# Altium schematic sheet USB to SATA bridge.SchDoc
size A3; SheetNumber: 2; SheetTotal: 3
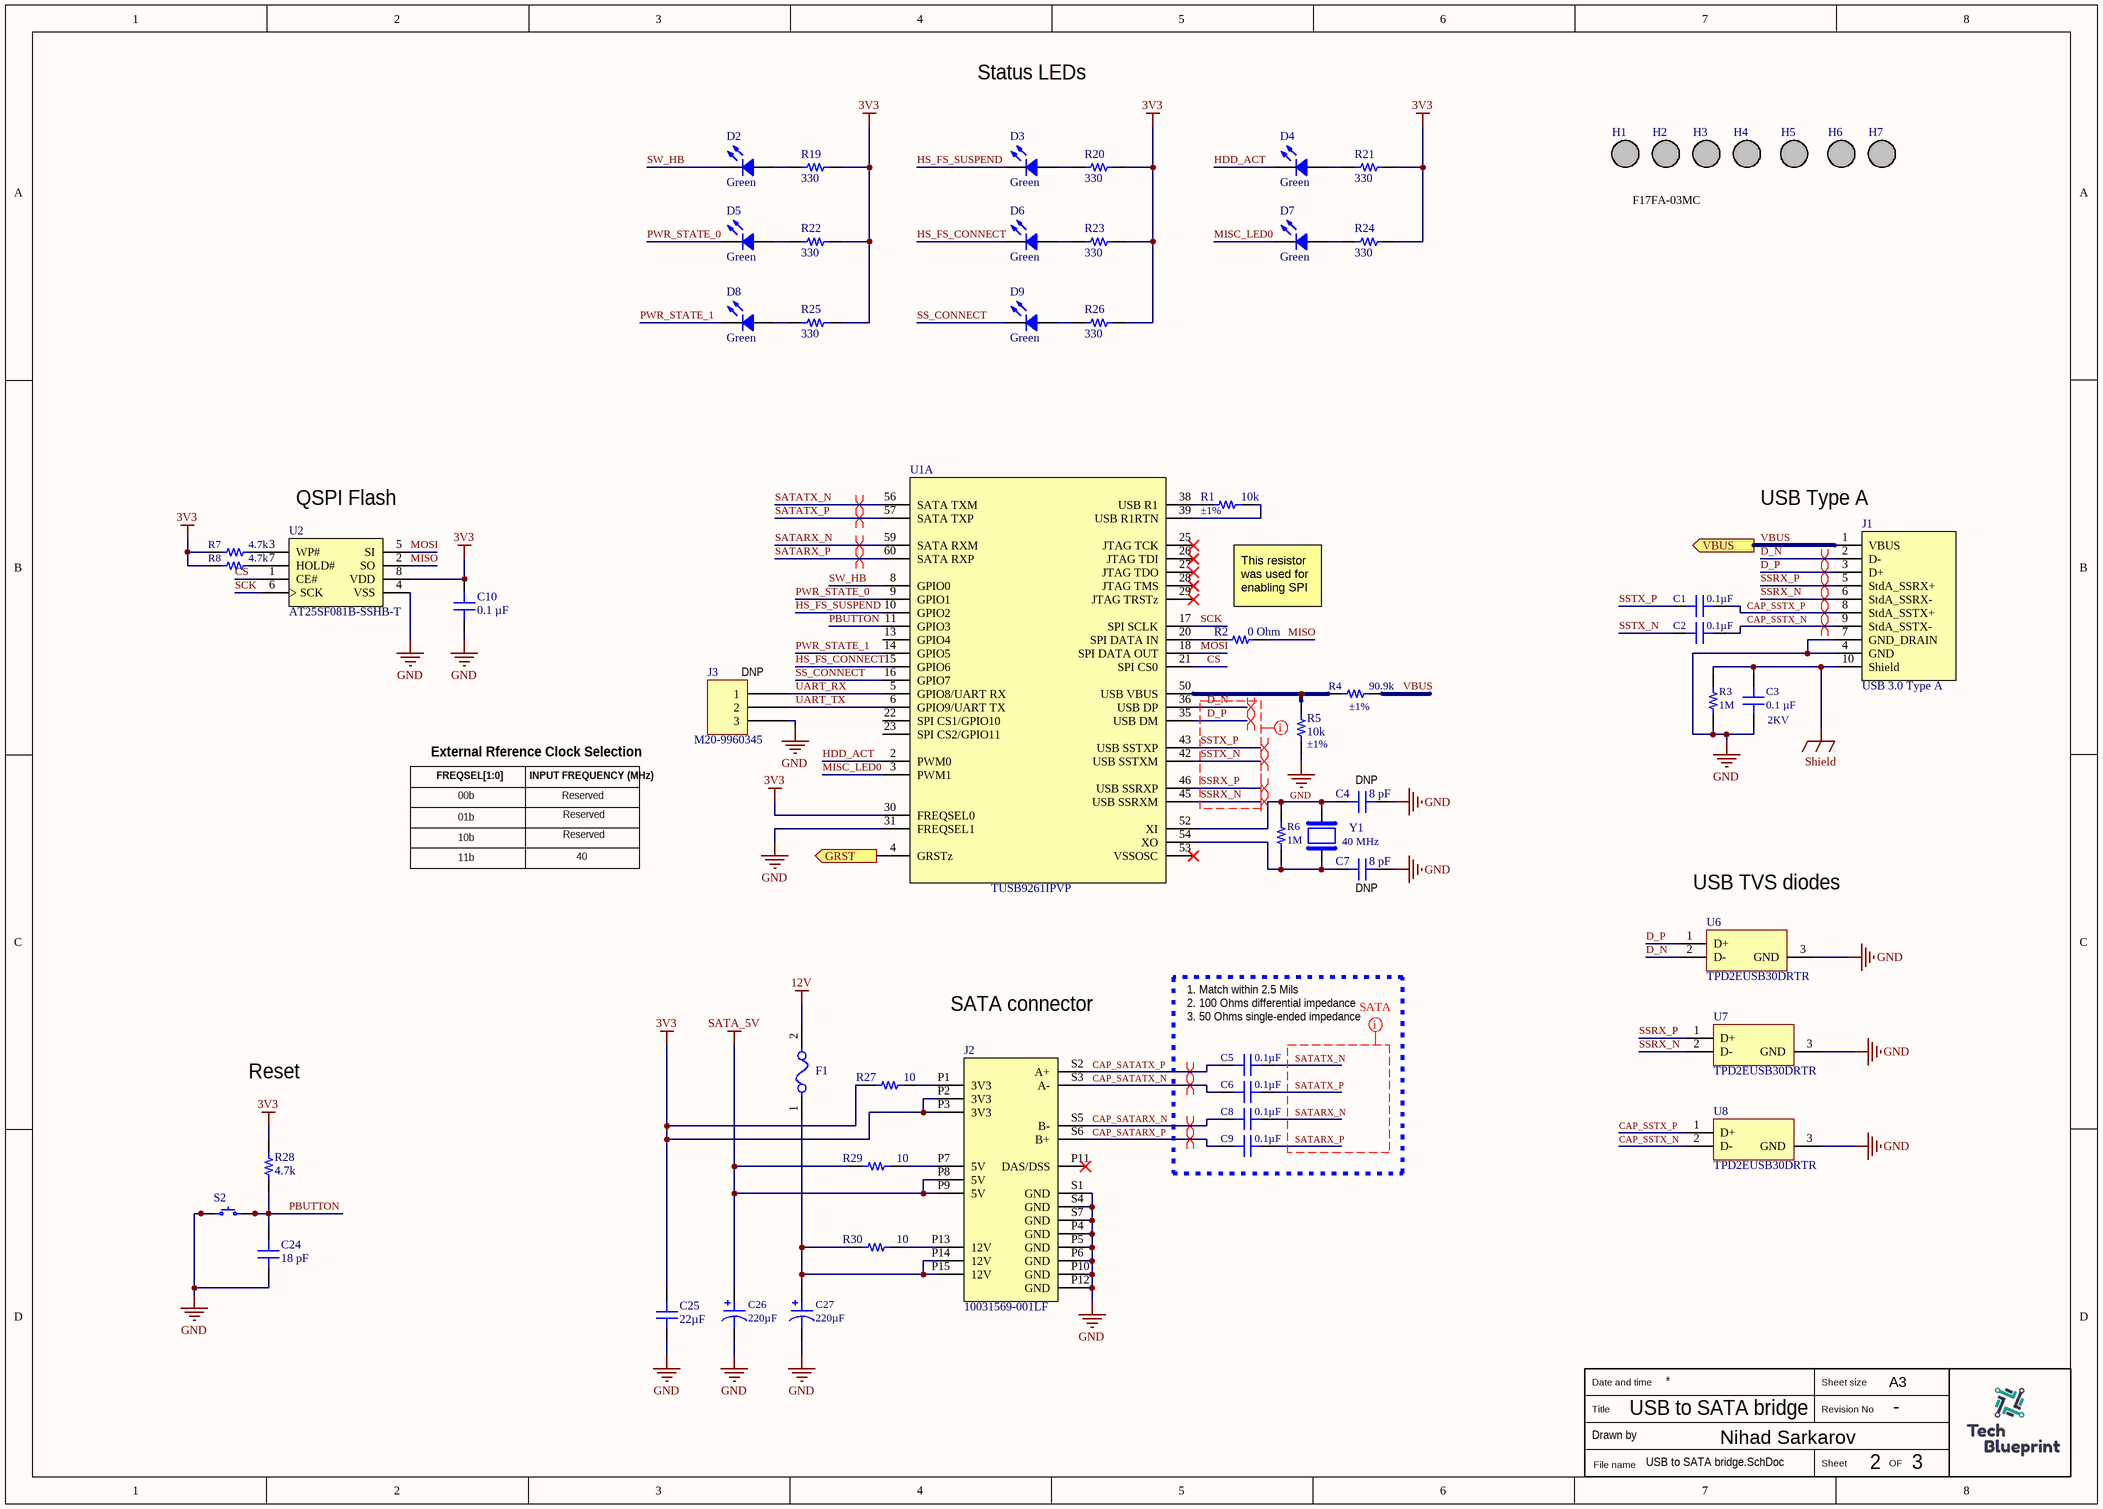
[diagram p0: USB to SATA bridge.SchDoc]

## Parts
C1  0.1µF  [CAP 0402_1005]
C2  0.1µF  [CAP 0402_1005]
C3  Voltage - Rated: 2KV  [MURATA GRM155 0402_1005]  (hidden comment: 0.1 µF)
C4  8 pF  [MURATA GCM155 0402_1005]
C5  0.1µF  [CAP 0402_1005]
C6  0.1µF  [CAP 0402_1005]
C7  8 pF  [MURATA GCM155 0402_1005]
C8  0.1µF  [CAP 0402_1005]
C9  0.1µF  [CAP 0402_1005]
C10  0.1 µF  [CAP 0603_1608]
C24  18 pF  [CAP 0402_1005]
C25  22µF  [CAP 1206_3216 - 1.8MM]
C26  220µF  [CAP ALSMD 8.3MM H10.5MM]
C27  220µF  [CAP ALSMD 8.3MM H10.5MM]
D2  Green  [LED 0805_2012 GREEN]
D3  Green  [LED 0805_2012 GREEN]
D4  Green  [LED 0805_2012 GREEN]
D5  Green  [LED 0805_2012 GREEN]
D6  Green  [LED 0805_2012 GREEN]
D7  Green  [LED 0805_2012 GREEN]
D8  Green  [LED 0805_2012 GREEN]
D9  Green  [LED 0805_2012 GREEN]
F1  MINISMDC150F/24-2  [FP-MINISMDC150F-MFG]  (value not drawn)
H1  Hole  [Hole]  (value not drawn)
H2  Hole  [Hole]  (value not drawn)
H3  Hole  [Hole]  (value not drawn)
H4  Mounting hole  [Mounting hole]  (value not drawn)
H5  Mounting hole  [Mounting hole]  (value not drawn)
H6  Mounting hole  [Mounting hole]  (value not drawn)
H7  Mounting hole  [Mounting hole]  (value not drawn)
J1  USB 3.0 Type A  [USB 3.0 Type A]
J2  10031569-001LF  [AMPHENOL_10031569-001LF]
J3  M20-9960345  [HARWIN M20-9960345]
R1  Tolerance: ±1%  [YAGEO RES 0402_1005]  (hidden comment: 10k)
R2  0 Ohm  [RES 0603_1608]
R3  1M  [RES 0603_1608]
R4  Tolerance: ±1%  [RES 0603_1608]  (hidden comment: 90.9k)
R5  Tolerance: ±1%  [YAGEO RES 0603_1608]  (hidden comment: 10k)
R6  1M  [YAGEO RES 0402_1005]
R7  4.7k  [RES 0603_1608]
R8  4.7k  [RES 0603_1608]
R19  330  [YAGEO RES 0402_1005]
R20  330  [YAGEO RES 0402_1005]
R21  330  [YAGEO RES 0402_1005]
R22  330  [YAGEO RES 0402_1005]
R23  330  [YAGEO RES 0402_1005]
R24  330  [YAGEO RES 0402_1005]
R25  330  [YAGEO RES 0402_1005]
R26  330  [YAGEO RES 0402_1005]
R27  10  [RES 1206_3216]
R28  4.7k  [YAGEO RES 0402_1005]
R29  10  [RES 1206_3216]
R30  10  [RES 1206_3216]
S2  PTS645SM43SMTR92 LFS  [C&K PTS645]  (value not drawn)
U1  TUSB9261IPVP  [FP-PVP0064A-IPC_A]  (part A of 2)
U2  AT25SF081B-SSHB-T  [SOIC127P790X216-8N]
U6  TPD2EUSB30DRTR  [DRT0003A]
U7  TPD2EUSB30DRTR  [DRT0003A]
U8  TPD2EUSB30DRTR  [DRT0003A]
Y1  Frequency: 40 MHz  [XTAL_SXT22412AA16-40.000MT]  (hidden comment: SXT22412AA07-40.000M)

## Ports
GRST (out, see Power[3D]), VBUS (out, see Power[7A])

## Nets
3V3: C10.2 C25.2 J2.P2(3V3) J2.P3(3V3) R7.1 R8.1 R19.2 R20.2 R21.2 R22.2 R23.2 R24.2 R25.2 R26.2 R27.1 R28.2 U1.30(FREQSEL0) U2.8(VDD)
12V: F1.2
GND: C3.1 C4.2 C7.2 C10.1 C24.1 C25.1 C26.2 C27.2 J1.4(GND) J1.7(GND_DRAIN) J2.P4(GND) J2.P5(GND) J2.P6(GND) J2.P10(GND) J2.P12(GND) J2.S1(GND) J2.S4(GND) J2.S7(GND) J3.3 R3.1 R5.1 S2.1 S2.2 U1.31(FREQSEL1) U2.4(VSS) U6.3(GND) U7.3(GND) U8.3(GND)
SATA_5V: C26.1 J2.P8(5V) J2.P9(5V) R29.1
Shield: C3.2 J1.10(Shield) R3.2
CAP_SATARX_N: C8.1 J2.S5(B-)
CAP_SATARX_P: C9.1 J2.S6(B+)
CAP_SATATX_N: C6.1 J2.S3(A-)
CAP_SATATX_P: C5.1 J2.S2(A+)
CAP_SSTX_N: C2.2 J1.9(StdA_SSTX-) U8.2(D-)
CAP_SSTX_P: C1.2 J1.8(StdA_SSTX+) U8.1(D+)
CS: U1.21(SPI_CS0) U2.1(CE#)
D_N: J1.2(D-) U1.36(USB_DP) U6.2(D-)
D_P: J1.3(D+) U1.35(USB_DM) U6.1(D+)
GRST: U1.4(GRSTz) ; port GRST
HDD_ACT: D4.2 U1.2(PWM0)
HS_FS_CONNECT: D6.2 U1.15(GPIO6)
HS_FS_SUSPEND: D3.2 U1.10(GPIO2)
MISC_LED0: D7.2 U1.3(PWM1)
MISO: R2.2 U2.2(SO)
MOSI: U1.18(SPI_DATA_OUT) U2.5(SI)
PBUTTON: C24.2 R28.1 S2.3 S2.4 U1.11(GPIO3)
PWR_STATE_0: D5.2 U1.9(GPIO1)
PWR_STATE_1: D8.2 U1.14(GPIO5)
SATARX_N: C8.2 U1.59(SATA_RXM)
SATARX_P: C9.2 U1.60(SATA_RXP)
SATATX_N: C5.2 U1.56(SATA_TXM)
SATATX_P: C6.2 U1.57(SATA_TXP)
SCK: U1.17(SPI_SCLK) U2.6(SCK)
SS_CONNECT: D9.2 U1.16(GPIO7)
SSRX_N: J1.6(StdA_SSRX-) U1.45(USB_SSRXM) U7.2(D-)
SSRX_P: J1.5(StdA_SSRX+) U1.46(USB_SSRXP) U7.1(D+)
SSTX_N: C2.1 U1.42(USB_SSTXM)
SSTX_P: C1.1 U1.43(USB_SSTXP)
SW_HB: D2.2 U1.8(GPIO0)
UART_RX: J3.1 U1.5(GPIO8/UART_RX)
UART_TX: J3.2 U1.6(GPIO9/UART_TX)
VBUS: J1.1(VBUS) R4.2 ; port VBUS
NetC4_1: C4.1 R6.2 U1.52(XI) Y1.3
NetC7_1: C7.1 R6.1 U1.54(XO) Y1.1
NetC27_1: C27.1 F1.1 J2.P14(12V) J2.P15(12V) R30.1
NetD2_1: D2.1 R19.1
NetD3_1: D3.1 R20.1
NetD4_1: D4.1 R21.1
NetD5_1: D5.1 R22.1
NetD6_1: D6.1 R23.1
NetD7_1: D7.1 R24.1
NetD8_1: D8.1 R25.1
NetD9_1: D9.1 R26.1
NetJ2_P1: J2.P1(3V3) R27.2
NetJ2_P7: J2.P7(5V) R29.2
NetJ2_P13: J2.P13(12V) R30.2
NetR1_1: R1.1 U1.38(USB_R1)
NetR1_2: R1.2 U1.39(USB_R1RTN)
NetR2_1: R2.1 U1.20(SPI_DATA_IN)
NetR4_1: R4.1 R5.2 U1.50(USB_VBUS)
NetR7_2: R7.2 U2.3(WP#)
NetR8_2: R8.2 U2.7(HOLD#)

Not connected (* = marked no-connect by the designer): J2 P11(DAS/DSS)*; U1 13(GPIO4) 22(SPI_CS1/GPIO10) 23(SPI_CS2/GPIO11) 25(JTAG_TCK)* 26(JTAG_TDI)* 27(JTAG_TDO)* 28(JTAG_TMS)* 29(JTAG_TRSTz)* 53(VSSOSC)*

## Layout directives
differential pair; differential pair class USB90: CAP_SSTX_N, CAP_SSTX_P, D_N, D_P, SSRX_N, SSRX_P, SSTX_N, SSTX_P
differential pair; differential pair class SATA100: CAP_SATARX_N, CAP_SATARX_P, CAP_SATATX_N, CAP_SATATX_P, SATARX_N, SATARX_P, SATATX_N, SATATX_P
net class SATA: SATARX_N, SATARX_P, SATATX_N, SATATX_P
net class USB_3.0: D_N, D_P, SSRX_N, SSRX_P, SSTX_N, SSTX_P

## Notes on the sheet
- Status LEDs
- F17FA-03MC
- QSPI Flash
- (near J1) USB Type A
- This resistor was used for enabling SPI
- (near J3) DNP
- External Rference Clock Selection
- FREQSEL[1:0]
- INPUT FREQUENCY (MHz)
- (near C4) DNP
- 00b
- 01b
- 10b
- Reserved
- 11b
- 40
- (near C7) DNP
- (near U6) USB TVS diodes
- 1. Match within 2.5 Mils
- SATA connector
- 2. 100 Ohms differential impedance
- (near C5) 3. 50 Ohms single-ended impedance
- Reset
- USB to SATA bridge
- -
- 2
- 3
- Date and time
- Sheet size
- A3
- Title
- Drawn by
- File name
- Nihad Sarkarov
- Sheet
- Revision No
- OF

## Library data of the parts
C1 C2 C5 C6 C8 C9 = 0402YC104JAT4A: CAP CER 0.1UF 16V X7R 0402; manufacturer: AVX Corporation; Tolerance: ±5%; Part Number: 0402YC104JAT4A; Capacitance: 0.1µF; Applications: General Purpose; componentlink1description: Datasheet; componentlink1url: http://datasheets.avx.com/X7RDielectric.pdf; componentlink2description: DigiKey Link; componentlink2url: http://digikey.com/product-detail/en/avx-corporation/0402YC104JAT4A/478-11502-1-ND/8107703; Device Package: 0402 (1005 Metric); lastupdated: 2/8/2022 12:26:57 PM; Lifecycle Status: Active; Minimum Order: 1; Mounting Type: Surface Mount, MLCC; Operating Temperature: -55°C ~ 125°C; Package / Case: 0402 (1005 Metric); packaging: CutTape; partid: 2382; Part Status: Active; price: 0.10; series: -; Size / Dimension: 0.039" L x 0.020" W (1.00mm x 0.50mm); Supplier 1: DigiKey; Supplier Part Number 1: 478-11502-1-ND; Temperature Coefficient: X7R; Thickness (Max): 0.022" (0.56mm); value: 0.1µF; Voltage - Rated: 16V
C3 = GRM155R62A104ME14D: CAP CER 0.1UF 100V X5R 0402; manufacturer: Murata Electronics; Tolerance: ±20%; Part Number: GRM155R62A104ME14D; Capacitance: 0.1 µF; Applications: General Purpose; componentlink1description: Datasheet; componentlink1url: https://search.murata.co.jp/Ceramy/image/img/A01X/G101/ENG/GRM155R62A104ME14-01.pdf; componentlink2description: DigiKey Link; componentlink2url: https://www.digikey.com/en/products/detail/murata-electronics/GRM155R62A104ME14D/5027544; Device Package: 0402 (1005 Metric); lastupdated: 7/25/2024 4:50:24 AM; Lifecycle Status: Active; Minimum Order: 1; Mounting Type: Surface Mount, MLCC; Operating Temperature: -55°C ~ 85°C; Package / Case: 0402 (1005 Metric); packaging: TapeAndReel; partid: 2773; Part Status: Active; price: 0.01; series: GRM; Size / Dimension: 0.039" L x 0.020" W (1.00mm x 0.50mm); Supplier 1: DigiKey; Supplier Part Number 1: 490-10459-1-ND; Temperature Coefficient: X5R; Thickness (Max): 0.022" (0.55mm); value: 0.1 µF
C4 C7 = GCM1555C1H8R0DA16D: CAP CER 8PF 50V C0G/NP0 0402; manufacturer: Murata Electronics; Temperature Coefficient: C0G, NP0; Tolerance: ±0.5pF; Part Number: GCM1555C1H8R0DA16D; Capacitance: 8 pF; Applications: Automotive; componentlink1description: Datasheet; componentlink1url: https://www.murata.com/~/media/webrenewal/support/library/catalog/products/capacitor/mlcc/c03e.ashx?la=en-us; componentlink2description: DigiKey Link; componentlink2url: https://www.digikey.com/en/products/detail/murata-electronics/GCM1555C1H8R0DA16D/4903668; Device Package: 0402 (1005 Metric); lastupdated: 7/20/2024 2:04:19 AM; Lifecycle Status: Active; Minimum Order: 1; Mounting Type: Surface Mount, MLCC; Operating Temperature: -55°C ~ 125°C; Package / Case: 0402 (1005 Metric); packaging: TapeAndReel; partid: 3031; Part Status: Active; price: 0.01; Ratings: AEC-Q200; series: GCM; Size / Dimension: 0.039" L x 0.020" W (1.00mm x 0.50mm); Supplier 1: DigiKey; Supplier Part Number 1: 490-13294-1-ND; Thickness (Max): 0.022" (0.55mm); value: 8 pF; Voltage - Rated: 50V
C10 = CL10B104KB85PND: CAP CER 0.1UF 50V X7R 0603; manufacturer: Samsung Electro-Mechanics; Tolerance: ±10%; Part Number: CL10B104KB85PND; Capacitance: 0.1 µF; Applications: Automotive; componentlink1description: Datasheet; componentlink1url: http://www.samsungsem.com/kr/support/product-search/mlcc/CL10B104KB85PND.jsp; componentlink2description: DigiKey Link; componentlink2url: https://www.digikey.com/en/products/detail/samsung-electro-mechanics/CL10B104KB85PND/7320490; Device Package: 0603 (1608 Metric); Features: Open Mode; lastupdated: 2/9/2024 8:10:28 PM; Lifecycle Status: Active; Minimum Order: 1; Mounting Type: Surface Mount, MLCC; Operating Temperature: -55°C ~ 125°C; Package / Case: 0603 (1608 Metric); packaging: TapeAndReel; partid: 4208; Part Status: Active; price: 0.01; Ratings: AEC-Q200; series: CL; Size / Dimension: 0.063" L x 0.031" W (1.60mm x 0.80mm); Supplier 1: DigiKey; Supplier Part Number 1: 1276-6985-1-ND; Temperature Coefficient: X7R; Thickness (Max): 0.035" (0.90mm); value: 0.1 µF; Voltage - Rated: 50V
C24 = CGA2B2C0G1H180J050BA: CAP CER 18PF 50V C0G 0402; manufacturer: TDK Corporation; Temperature Coefficient: C0G, NP0; Tolerance: ±5%; Part Number: CGA2B2C0G1H180J050BA; Capacitance: 18 pF; Applications: Automotive; componentlink1description: Datasheet; componentlink1url: https://product.tdk.com/info/en/catalog/datasheets/mlcc_automotive_general_en.pdf?ref_disty=digikey; componentlink2description: DigiKey Link; componentlink2url: https://www.digikey.com/en/products/detail/tdk-corporation/CGA2B2C0G1H180J050BA/2443065; Device Package: 0402 (1005 Metric); lastupdated: 2/9/2024 8:04:35 PM; Lifecycle Status: Active; Minimum Order: 1; Mounting Type: Surface Mount, MLCC; Operating Temperature: -55°C ~ 125°C; Package / Case: 0402 (1005 Metric); packaging: TapeAndReel; partid: 3334; Part Status: Active; price: 0.01; Ratings: AEC-Q200; series: CGA; Size / Dimension: 0.039" L x 0.020" W (1.00mm x 0.50mm); Supplier 1: DigiKey; Supplier Part Number 1: 445-5587-1-ND; Thickness (Max): 0.022" (0.55mm); value: 18 pF; Voltage - Rated: 50V
C25 = 1206YD226KAT2A: CAP CER 22UF 16V X5R 1206; manufacturer: AVX Corporation; Tolerance: ±10%; Part Number: 1206YD226KAT2A; Capacitance: 22µF; Applications: General Purpose; componentlink1description: Datasheet; componentlink1url: http://datasheets.avx.com/cx5r.pdf; componentlink2description: DigiKey Link; componentlink2url: http://digikey.com/product-detail/en/avx-corporation/1206YD226KAT2A/478-5727-1-ND/2136335; Device Package: 1206 (3216 Metric); lastupdated: 9/2/2020 1:05:39 AM; Lifecycle Status: Active; Minimum Order: 1; Mounting Type: Surface Mount, MLCC; Operating Temperature: -55°C ~ 85°C; Package / Case: 1206 (3216 Metric); packaging: TapeAndReel; partid: 20319; Part Status: Active; price: 0.48; series: -; Size / Dimension: 0.126" L x 0.063" W (3.20mm x 1.60mm); Supplier 1: DigiKey; Supplier Part Number 1: 478-5727-1-ND; Temperature Coefficient: X5R; Thickness (Max): 0.070" (1.78mm); value: 22µF; Voltage - Rated: 16V
C26 C27 = UUR1E221MNL6GS: CAP ALUM 220UF 20% 25V SMD; manufacturer: Nichicon; Lifetime @ Temp.: 2000 Hrs @ 85°C; Ripple Current @ High Frequency: 301.6mA @ 10kHz; Ripple Current @ Low Frequency: 232mA @ 120Hz; Surface Mount Land Size: 0.327" L x 0.327" W (8.30mm x 8.30mm); Part Number: UUR1E221MNL6GS; Applications: General Purpose; Capacitance: 220µF; componentlink1description: Datasheet; componentlink1url: http://nichicon-us.com/english/products/pdfs/e-uur.pdf; componentlink2description: DigiKey Link; componentlink2url: http://digikey.com/product-detail/en/nichicon/UUR1E221MNL6GS/493-6222-1-ND/3438735; Device Package: Radial, Can - SMD; Height - Seated (Max): 0.413" (10.50mm); lastupdated: 9/2/2020 1:25:16 AM; Lifecycle Status: Active; Minimum Order: 1; Mounting Type: Surface Mount; Operating Temperature: -40°C ~ 85°C; Package / Case: Radial, Can - SMD; packaging: TapeAndReel; partid: 7456; Part Status: Active; price: 0.19; series: UUR; Size / Dimension: 0.315" Dia (8.00mm); Supplier 1: DigiKey; Supplier Part Number 1: 493-6222-1-ND; Tolerance: ±20%; value: 220µF; Voltage - Rated: 25V
D2-D9 = QBLP631-YG1-2943: 0805 LED RED 570NM DOMINANT, 565; Manufacturer: QT Brightek (QTB); Configuration: Standard; Current - Test: 20mA; Lens Color: White; Lens Size: 1.30mm x 1.25mm; Lens Style: Rectangle with Flat Top; Lens Transparency: Diffused; Millicandela Rating: 15mcd; Viewing Angle: 140°; Voltage - Forward (Vf) (Typ): 2V; Wavelength - Peak: 565nm; Part Number: QBLP631-YG1-2943; Color: Green; ComponentLink1Description: Datasheet; ComponentLink1URL: https://www.qt-brightek.com/datasheet/QBLP631-YG1-2943.pdf; ComponentLink2Description: DigiKey Link; ComponentLink2URL: https://www.digikey.com/en/products/detail/qt-brightek-qtb/QBLP631-YG1-2943/22106671; Device Package: 0805 (2012 Metric); Height (Max): 0.90mm; LastUpdated: 6/3/2024 8:00:23 PM; Lifecycle Status: Active; Minimum Order: 1; Mounting Type: Surface Mount; Package / Case: 0805 (2012 Metric); Packaging: TapeAndReel; PartId: 1479; Price: 0.05; Series: QBLP631; Size / Dimension: 2.00mm L x 1.25mm W; Supplier 1: DigiKey; Supplier Part Number 1: 1516-QBLP631-YG1-2943CT-ND; Supplier Device Package: 0805; Value: Green; Wavelength - Dominant: 570nm
F1 = CMP-08606-000055-1: PTC RESET FUSE 24V 1.5A 1812; Manufacturer: Littelfuse; Trip Current: 3A; Value: 0.04-0.12Ω; Current Rating: 20A; Trip Time: 1.5s; Temperature: to +85°C; Digikey Description: PTC RESET FUSE 24V 1.5A 1812; Device Class L3: unset; Device Class L2: PTC Resettable Fuses; RoHS: TRUE; Ambient Temperature Range High: +85°C; Category: Fuse; Device Class L1: Circuit Protection; Hold Current: 1.5A; Resistance: 0.04-0.12Ω; ComponentLink2URL: https://www.littelfuse.com/~/media/electronics/datasheets/resettable_ptcs/littelfuse_ptc_minismdc_datasheet.pdf.pdf; ComponentLink2Description: Datasheet; Package: MINISMDC150F; Ambient Temperature Range Low: -40°C; Height: 1.94mm; Octopart: https://octopart.com/minismdc150f%2F24-2-littelfuse-74215024; Manufacturer Part Number: MINISMDC150F/24-2; Automotive: No; Voltage Rating: 24V; Temperature Range High: +85°C; Lead Free: Yes
J1 = USB 3.0 Type A: USB 3.0 Type A male connector
J2 = 10031569-001LF: MF: {'manufacturer': u'Amphenol ICC'}; Package: None; Price: None; Value: *; MP: 10031569-001LF; Availability: Unavailable
J3 = M20-9960345: CONN HEADER R/A 3POS 2.54MM; Manufacturer: Harwin Inc.; Connector Type: Header, Cuttable; Contact Length - Mating: 0.240" (6.10mm); Contact Length - Post: 0.118" (3.00mm); Current Rating (Amps): 3A per Contact; Material Flammability Rating: UL94 V-0; Number of Positions: 3; Number of Positions Loaded: All; Pitch - Mating: 0.100" (2.54mm); Row Spacing - Mating: -40°C ~ 105°C; Shrouding: Unshrouded; Style: Board to Board or Cable; Part Number: M20-9960345; ComponentLink1Description: Datasheet; ComponentLink1URL: https://cdn.harwin.com/pdfs/Harwin_PC_Connectors_M20.pdf; ComponentLink2Description: DigiKey Link; ComponentLink2URL: https://www.digikey.com/en/products/detail/harwin-inc/M20-9960345/3728209; Contact Finish - Mating: Gold; Contact Material: Brass; Contact Shape: Square; Contact Type: Male Pin; Fastening Type: Push-Pull; Insulation Color: Black; Insulation Height: 0.100" (2.54mm); Insulation Material: Polyamide (PA6T), Nylon 6T; LastUpdated: 9/21/2022 7:23:07 PM; Lifecycle Status: Active; Minimum Order: 1; Mounting Type: Through Hole, Right Angle; Number of Rows: 1; Operating Temperature: -40°C ~ 105°C; Packaging: Bulk; PartId: 166; Part Status: Active; Price: 0.09; Series: M20; Supplier 1: DigiKey; Supplier Part Number 1: 952-2245-ND; Termination: Solder
R1 = SR0402FR-7T10KL: RES 10K OHM 1% 1/5W 0402; Manufacturer: Yageo; Power (Watts): 0.2W, 1/5W; Resistance: 10 kOhms; Temperature Coefficient: ±100ppm/°C; Part Number: SR0402FR-7T10KL; Value: 10k; ComponentLink1Description: Datasheet; ComponentLink1URL: http://www.yageo.com/documents/recent/PYu-SR_D_F%20tol_RoHS_L_4.pdf; ComponentLink2Description: DigiKey Link; ComponentLink2URL: https://www.digikey.com/en/products/detail/yageo/SR0402FR-7T10KL/9373089; Composition: Thick Film; Device Package: 0402 (1005 Metric); Features: Automotive AEC-Q200, Pulse Withstanding; Height - Seated (Max): 0.016" (0.40mm); LastUpdated: 7/25/2024 9:18:17 AM; Lifecycle Status: Active; Minimum Order: 1; Number of Terminations: 2; Operating Temperature: -55°C ~ 155°C; Package / Case: 0402 (1005 Metric); Packaging: TapeAndReel; PartId: 4411; Part Status: Active; Price: 0.09; Ratings: AEC-Q200; Series: SR; Size / Dimension: 0.039" L x 0.020" W (1.00mm x 0.50mm); Supplier 1: DigiKey; Supplier Part Number 1: YAG5815CT-ND; Supplier Device Package: 0402
R2 = RCS06030000Z0EC: RCS0603 0R0 ET6 E3; Manufacturer: Vishay Dale; Power (Watts): 0.25W, 1/4W; Resistance: 0 Ohms; Tolerance: Jumper; Part Number: RCS06030000Z0EC; Value: 0 Ohm; ComponentLink1Description: Datasheet; ComponentLink1URL: http://www.vishay.com/docs/20065/rcse3.pdf; ComponentLink2Description: DigiKey Link; ComponentLink2URL: https://www.digikey.com/en/products/detail/vishay-dale/RCS06030000Z0EC/10059623; Composition: Thick Film; Device Package: 0603 (1608 Metric); Features: Automotive AEC-Q200, Pulse Withstanding; Height - Seated (Max): 0.020" (0.50mm); LastUpdated: 2/9/2024 8:42:16 PM; Lifecycle Status: Active; Minimum Order: 1; Number of Terminations: 2; Operating Temperature: -55°C ~ 155°C; Package / Case: 0603 (1608 Metric); Packaging: TapeAndReel; PartId: 23936; Part Status: Active; Price: 0.01; Ratings: AEC-Q200; Series: RCS e3; Size / Dimension: 0.061" L x 0.033" W (1.55mm x 0.85mm); Supplier 1: DigiKey; Supplier Part Number 1: 541-10557-1-ND; Supplier Device Package: 0603
R3 = RMCF0603JT1M00: RES 1M OHM 5% 1/10W 0603; Manufacturer: Stackpole Electronics Inc; Power (Watts): 0.1W, 1/10W; Resistance: 1 MOhms; Temperature Coefficient: ±200ppm/°C; Part Number: RMCF0603JT1M00; Value: 1M; ComponentLink1Description: Datasheet; ComponentLink1URL: https://www.seielect.com/catalog/sei-rmcf_rmcp.pdf; ComponentLink2Description: DigiKey Link; ComponentLink2URL: https://www.digikey.com/en/products/detail/stackpole-electronics-inc/RMCF0603JT1M00/1758066; Composition: Thick Film; Device Package: 0603 (1608 Metric); Features: Automotive AEC-Q200; Height - Seated (Max): 0.022" (0.55mm); LastUpdated: 2/9/2024 8:43:33 PM; Lifecycle Status: Active; Minimum Order: 1; Number of Terminations: 2; Operating Temperature: -55°C ~ 155°C; Package / Case: 0603 (1608 Metric); Packaging: CutTape; PartId: 5847; Part Status: Active; Price: 0.01; Ratings: AEC-Q200; Series: RMCF; Size / Dimension: 0.061" L x 0.031" W (1.55mm x 0.80mm); Supplier 1: DigiKey; Supplier Part Number 1: RMCF0603JT1M00CT-ND; Supplier Device Package: 0603; Tolerance: ±5%
R4 = MCT06030C9092FP500: RES SMD 90.9K OHM 1% 1/8W 0603; Manufacturer: Vishay Beyschlag; Power (Watts): 0.125W, 1/8W; Resistance: 90.9 kOhms; Temperature Coefficient: ±50ppm/°C; Part Number: MCT06030C9092FP500; Value: 90.9k; ComponentLink1Description: Datasheet; ComponentLink1URL: http://www.vishay.com/docs/28705/mcx0x0xpro.pdf; ComponentLink2Description: DigiKey Link; ComponentLink2URL: http://digikey.com/product-detail/en/vishay-beyschlag/MCT06030C9092FP500/749-MCT06030C9092FP500CT-ND/10453922; Composition: Thin Film; Device Package: 0603 (1608 Metric); Features: Anti-Sulfur; Height - Seated (Max): 0.022" (0.55mm); LastUpdated: 2/9/2024 8:43:36 PM; Lifecycle Status: Active; Minimum Order: 1; Number of Terminations: 2; Operating Temperature: -55°C ~ 155°C; Package / Case: 0603 (1608 Metric); Packaging: TapeAndReel; PartId: 5107; Part Status: Active; Price: 0.02; Series: MCT - Professional; Size / Dimension: 0.061" L x 0.033" W (1.55mm x 0.85mm); Supplier 1: DigiKey; Supplier Part Number 1: 749-MCT06030C9092FP500CT-ND; Supplier Device Package: 0603
R5 = RT0603FRE0710KL: RES SMD 10K OHM 1% 1/10W 0603; Manufacturer: Yageo; Power (Watts): 0.1W, 1/10W; Resistance: 10 kOhms; Temperature Coefficient: ±50ppm/°C; Part Number: RT0603FRE0710KL; Value: 10k; ComponentLink1Description: Datasheet; ComponentLink1URL: https://www.yageo.com/upload/media/product/productsearch/datasheet/rchip/PYu-RT_1-to-0.01_RoHS_L_11.pdf; ComponentLink2Description: DigiKey Link; ComponentLink2URL: https://www.digikey.com/en/products/detail/yageo/RT0603FRE0710KL/1075040; Composition: Thin Film; Device Package: 0603 (1608 Metric); Height - Seated (Max): 0.022" (0.55mm); LastUpdated: 7/25/2024 9:19:32 AM; Lifecycle Status: Active; Minimum Order: 1; Number of Terminations: 2; Operating Temperature: -55°C ~ 155°C; Package / Case: 0603 (1608 Metric); Packaging: TapeAndReel; PartId: 5671; Part Status: Active; Price: 0.01; Series: RT; Size / Dimension: 0.063" L x 0.031" W (1.60mm x 0.80mm); Supplier 1: DigiKey; Supplier Part Number 1: YAG2321CT-ND; Supplier Device Package: 0603
R6 = AC0402JR-071ML: RES SMD 1M OHM 5% 1/16W 0402; Manufacturer: Yageo; Power (Watts): 0.063W, 1/16W; Resistance: 1 MOhms; Temperature Coefficient: ±100ppm/°C; Part Number: AC0402JR-071ML; Value: 1M; ComponentLink1Description: Datasheet; ComponentLink1URL: https://www.yageo.com/upload/media/product/productsearch/datasheet/rchip/PYu-AC_51_RoHS_L_7.pdf; ComponentLink2Description: DigiKey Link; ComponentLink2URL: https://www.digikey.com/en/products/detail/yageo/AC0402JR-071ML/5895610; Composition: Thick Film; Device Package: 0402 (1005 Metric); Features: Automotive AEC-Q200, Moisture Resistant; Height - Seated (Max): 0.015" (0.37mm); LastUpdated: 7/25/2024 9:18:18 AM; Lifecycle Status: Active; Minimum Order: 1; Number of Terminations: 2; Operating Temperature: -55°C ~ 155°C; Package / Case: 0402 (1005 Metric); Packaging: CutTape; PartId: 3387; Part Status: Active; Price: 0.01; Ratings: AEC-Q200; Series: AC; Size / Dimension: 0.039" L x 0.020" W (1.00mm x 0.50mm); Supplier 1: DigiKey; Supplier Part Number 1: YAG3526CT-ND; Supplier Device Package: 0402; Tolerance: ±5%
R7 R8 = RMCF0603JT4K70: RES 4.7K OHM 5% 1/10W 0603; Manufacturer: Stackpole Electronics Inc; Power (Watts): 0.1W, 1/10W; Resistance: 4.7 kOhms; Temperature Coefficient: ±200ppm/°C; Part Number: RMCF0603JT4K70; Value: 4.7k; ComponentLink1Description: Datasheet; ComponentLink1URL: https://www.seielect.com/catalog/sei-packaging.pdf; ComponentLink2Description: DigiKey Link; ComponentLink2URL: https://www.digikey.com/en/products/detail/stackpole-electronics-inc/RMCF0603JT4K70/1757976; Composition: Thick Film; Device Package: 0603 (1608 Metric); Features: Automotive AEC-Q200; Height - Seated (Max): 0.022" (0.55mm); LastUpdated: 2/9/2024 8:43:33 PM; Lifecycle Status: Active; Minimum Order: 1; Number of Terminations: 2; Operating Temperature: -55°C ~ 155°C; Package / Case: 0603 (1608 Metric); Packaging: CutTape; PartId: 5821; Part Status: Active; Price: 0.01; Ratings: AEC-Q200; Series: RMCF; Size / Dimension: 0.061" L x 0.031" W (1.55mm x 0.80mm); Supplier 1: DigiKey; Supplier Part Number 1: RMCF0603JT4K70CT-ND; Supplier Device Package: 0603; Tolerance: ±5%
R19-R26 = AC0402JR-07330RL: RES SMD 330 OHM 5% 1/16W 0402; Manufacturer: Yageo; Power (Watts): 0.063W, 1/16W; Resistance: 330 Ohms; Temperature Coefficient: ±100ppm/°C; Part Number: AC0402JR-07330RL; Value: 330; ComponentLink1Description: Datasheet; ComponentLink1URL: https://www.yageo.com/upload/media/product/productsearch/datasheet/rchip/PYu-AC_51_RoHS_L_7.pdf; ComponentLink2Description: DigiKey Link; ComponentLink2URL: https://www.digikey.com/en/products/detail/yageo/AC0402JR-07330RL/5895651; Composition: Thick Film; Device Package: 0402 (1005 Metric); Features: Automotive AEC-Q200, Moisture Resistant; Height - Seated (Max): 0.015" (0.37mm); LastUpdated: 7/25/2024 9:18:18 AM; Lifecycle Status: Active; Minimum Order: 1; Number of Terminations: 2; Operating Temperature: -55°C ~ 155°C; Package / Case: 0402 (1005 Metric); Packaging: CutTape; PartId: 3389; Part Status: Active; Price: 0.01; Ratings: AEC-Q200; Series: AC; Size / Dimension: 0.039" L x 0.020" W (1.00mm x 0.50mm); Supplier 1: DigiKey; Supplier Part Number 1: YAG3542CT-ND; Supplier Device Package: 0402; Tolerance: ±5%
R27 R29 R30 = RCC120610R0JNEA: RCC1206 200 10R 5% ET1 E3; Manufacturer: Vishay Dale; Power (Watts): 0.5W, 1/2W; Resistance: 10 Ohms; Temperature Coefficient: ±200ppm/°C; Value: 10 Ohms; Part Number: RCC120610R0JNEA; ComponentLink1Description: Datasheet; ComponentLink1URL: https://www.vishay.com/doc?20066; ComponentLink2Description: DigiKey Link; ComponentLink2URL: https://www.digikey.com/en/products/detail/vishay-dale/RCC120610R0JNEA/13667046; Composition: Thick Film; Device Package: 1206 (3216 Metric); Features: Automotive AEC-Q200; Height - Seated (Max): 0.024" (0.60mm); LastUpdated: 2/9/2024 8:53:25 PM; Lifecycle Status: Active; Minimum Order: 1; Number of Terminations: 2; Operating Temperature: -55°C ~ 155°C; Package / Case: 1206 (3216 Metric); Packaging: TapeAndReel; PartId: 58761; Part Status: Active; Price: 0.02; Ratings: AEC-Q200; Series: RCC e3; Size / Dimension: 0.126" L x 0.063" W (3.20mm x 1.60mm); Supplier 1: DigiKey; Supplier Part Number 1: 541-RCC120610R0JNEACT-ND; Supplier Device Package: 1206; Tolerance: ±5%
R28 = AC0402JR-074K7L: RES SMD 4.7K OHM 5% 1/16W 0402; Manufacturer: Yageo; Power (Watts): 0.063W, 1/16W; Resistance: 4.7 kOhms; Temperature Coefficient: ±100ppm/°C; Part Number: AC0402JR-074K7L; Value: 4.7k; ComponentLink1Description: Datasheet; ComponentLink1URL: https://www.yageo.com/upload/media/product/productsearch/datasheet/rchip/PYu-AC_51_RoHS_L_7.pdf; ComponentLink2Description: DigiKey Link; ComponentLink2URL: https://www.digikey.com/en/products/detail/yageo/AC0402JR-074K7L/2827810; Composition: Thick Film; Device Package: 0402 (1005 Metric); Features: Automotive AEC-Q200, Moisture Resistant; Height - Seated (Max): 0.015" (0.37mm); LastUpdated: 7/25/2024 9:18:18 AM; Lifecycle Status: Active; Minimum Order: 1; Number of Terminations: 2; Operating Temperature: -55°C ~ 155°C; Package / Case: 0402 (1005 Metric); Packaging: CutTape; PartId: 3400; Part Status: Active; Price: 0.01; Ratings: AEC-Q200; Series: AC; Size / Dimension: 0.039" L x 0.020" W (1.00mm x 0.50mm); Supplier 1: DigiKey; Supplier Part Number 1: 311-4.7KLBCT-ND; Supplier Device Package: 0402; Tolerance: ±5%
S2 = PTS645SM43SMTR92 LFS: SWITCH TACTILE SPST-NO 0.05A 12V; Manufacturer: C&K; Actuator Height off PCB, Vertical: 4.30mm; Actuator Orientation: Top Actuated; Actuator Type: Standard; Contact Rating @ Voltage: 0.05A @ 12VDC; Illumination: Non-Illuminated; Operating Force: 160gf; Outline: 6.00mm x 6.00mm; Switch Function: Off-Mom; Part Number: PTS645SM43SMTR92 LFS; Circuit: SPST-NO; ComponentLink1Description: Datasheet; ComponentLink1URL: https://dznh3ojzb2azq.cloudfront.net/products/Tactile/PTS645/documents/datasheet.pdf; ComponentLink2Description: DigiKey Link; ComponentLink2URL: http://digikey.com/product-detail/en/c-k/PTS645SM43SMTR92-LFS/CKN9112CT-ND/1146934; Features: Blue Actuator; LastUpdated: 4/9/2020 9:59:00 AM; Lifecycle Status: Active; Minimum Order: 1; Mounting Type: Surface Mount; Operating Temperature: -20°C ~ 60°C; Packaging: TapeAndReel; Part Status: Active; Price: 0.09; Series: PTS645; Supplier 1: DigiKey; Supplier Part Number 1: CKN9112CT-ND; Termination Style: Gull Wing
U1 = TUSB9261IPVP: HDD, CD, DVD Drive Interface 64-HTQFP (7x7); Manufacturer: Texas Instruments; Interface: USB; Supplier 1: Mouser; Supplier Part Number 1: 595-TUSB9261IPVP; DigiKey Part Number: 296-35545-ND; Manufacturer Product Number: TUSB9261IPVP; Applications: HDD, CD, DVD Drive; Package / Case: 64-TQFP Exposed Pad
U2 = SST25VF016B-75-4I-S2AF-T: FLASH - NOR Memory IC 8Mbit SPI - Quad I/O 108 MHz 8-SOIC; MF: {'manufacturer': u'Microchip Technology'}; Package: None; Price: None; Value: *; MP: SST25VF016B-75-4I-S2AF-T; Availability: Unavailable
U6-U8 = CMP-0326-00046-3: ESD Solution for Super-Speed (6 Gbps) USB 3.0 Interface, 2 Channels, -40 to +85 degC, 3-pin SOT (DRT), Green (Rohs & No Sb/Br); Manufacturer: Texas Instruments; Differential Capacitance(pF): 0.01; Breakdown Voltage(Min)(V): 9; HDMI: TRUE; IEC 61000-4-2 Air-Gap(+/- kV): 8; IO Leakage Current(nA): 10; IO Capacitance(Typ)(pF): 0.7; Mounting Technology: Surface Mount; PackageDescription: 3-Flat Lead Plastic Small Outline, 1 x 1 mm (inc leads), 0.35 mm Pitch; IEC 61000-4-2 Contact(+/- kV): 8; USB Super Speed: TRUE; Eco-Plan: Green (RoHS & no Sb/Br); USB High Speed: TRUE; PackageReference: DRT0003A; SubFamily: ESD Solution; USB Full Speed: TRUE; ComponentLink1Description: Datasheet; ComponentLink2URL: SamplesURL:http://www.ti.com/product/tpd2eusb30#samples; PackageVersion: revD, Jun-2008; ComponentLink2Description: URL Link1; 1394 / Firewire: TRUE; PartNumber: TPD2EUSB30DRTR; ComponentLink1URL: http://www.ti.com/general/docs/lit/getliterature.tsp?genericPartNumber=TPD2EUSB30&fileType=pdf; DatasheetVersion: SLVSAC2C; Serial ATA / eSATA: TRUE
Y1 = SXT22412AA07-40.000M: 40 MHz ±50ppm Crystal 12pF 50 Ohms 4-SMD, No Lead; MF: Suntsu Electronics, Inc; Package: 4-SMD, No Lead; MP: SXT22412AA07-40.000M; Supplier 1: Digikey; Supplier Part Number 1: 2388-SXT22412AA07-40.000MTR-ND; Type: MHz Crystal; Frequency Stability: ±50ppm; Frequency Tolerance: ±50ppm